# Altium schematic sheet Sheet1.SchDoc
size A3
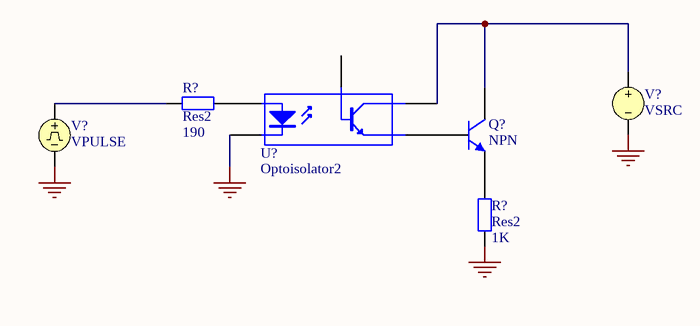
[diagram p0: Sheet1.SchDoc]

## Parts
(Parts that share a designator on the sheet are numbered #1, #2 ... from top to bottom, then left to right.)
Q?  NPN  [BCY-W3]
R?#1  Res2  value 190  [AXIAL-0.4]
R?#2  Res2  value 1K  [AXIAL-0.4]
U?  Optoisolator2  [SO-G5/P.95]
V?#1  VSRC
V?#2  VPULSE

## Nets
GND: R?#2.1 U?.2(K) V?#1.2 V?#2.2
NetQ?_1: Q?.1(C) U?.4(C) V?#1.1
NetQ?_2: Q?.2(B) U?.5(E)
NetQ?_3: Q?.3(E) R?#2.2
NetR?#1_1: R?#1.1 V?#2.1
NetR?#1_2: R?#1.2 U?.1(A)

Not connected (* = marked no-connect by the designer): U? 3(B)

## Library data of the parts
Q? = NPN: NPN Bipolar Transistor; Code - JEDEC: TO-226-AA; Published: 8-Jun-2000; Revision: July-2002: Re-released for DXP Platform.; Publisher: Altium Limited
R?#1 R?#2 = Res2: Resistor; Published: 8-Jun-2000; Revision: July-2002: Re-released for DXP Platform.; Publisher: Altium Limited
U? = Optoisolator2: Optoisolator; Published: 24-Mar-1999; Revision: July-2002: Re-released for DXP Platform.; Publisher: Altium Limited
V?#1 = VSRC: Voltage Source; Manufacturer: Generic Components; Class: Simulation; Note: PCB Footprint - Not required; Published: 8/06/2000; Publisher: Altium Hobart Technology Centre; Sub-Class: Voltage Source
V?#2 = VPULSE: Pulse Voltage Source; Manufacturer: Generic Components; Class: Simulation; Note: PCB Footprint - Not required; Published: 8/06/2000; Publisher: Altium Hobart Technology Centre; Sub-Class: Voltage Source